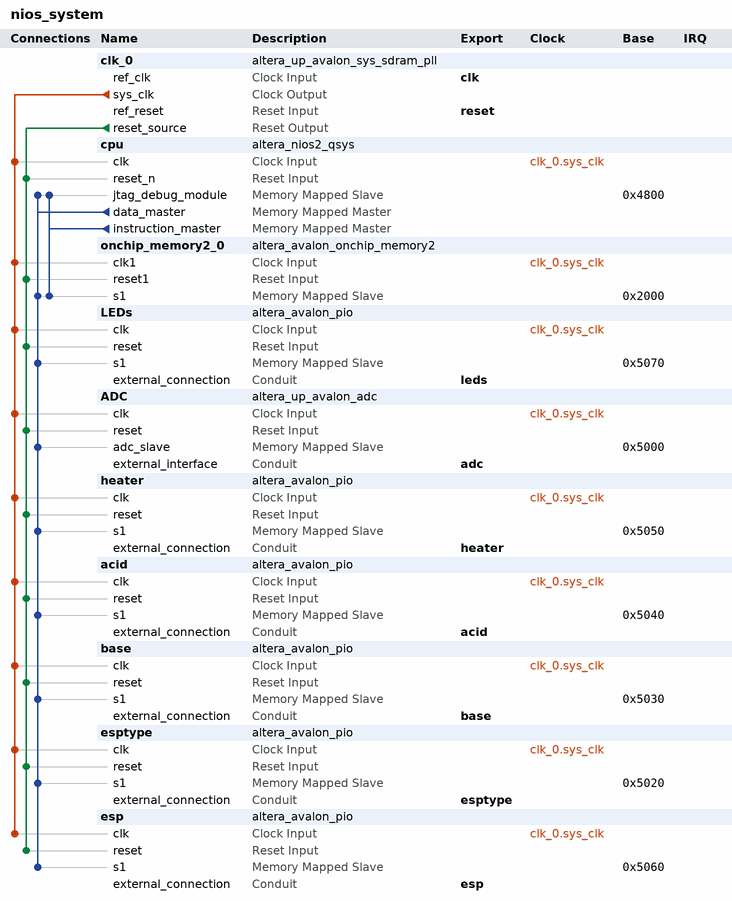
[diagram p0: system contents]
# Platform Designer (Qsys) system nios_system, Cyclone V 5CSEBA6U23I7
# Parameters at their usual value, and those the tool derives, are not listed.
package require -exact qsys 18.1
create_system nios_system
set_project_property DEVICE_FAMILY {Cyclone V}
set_project_property DEVICE 5CSEBA6U23I7

add_instance clk_0 altera_up_avalon_sys_sdram_pll 18.0
set_instance_parameter_value clk_0 CV_boards DE10-Nano
set_instance_parameter_value clk_0 gui_outclk 100.0
set_instance_parameter_value clk_0 gui_refclk 50.0

add_instance cpu altera_nios2_qsys 16.1
set_instance_parameter_value cpu breakSlave cpu.jtag_debug_module
set_instance_parameter_value cpu exceptionSlave onchip_memory2_0.s1
set_instance_parameter_value cpu icache_size 4096
set_instance_parameter_value cpu impl Tiny
set_instance_parameter_value cpu mmu_TLBMissExcSlave None
set_instance_parameter_value cpu resetSlave onchip_memory2_0.s1
set_instance_parameter_value cpu resetrequest_enabled true

add_instance onchip_memory2_0 altera_avalon_onchip_memory2 18.1
set_instance_parameter_value onchip_memory2_0 dataWidth 32
set_instance_parameter_value onchip_memory2_0 dualPort false
set_instance_parameter_value onchip_memory2_0 initMemContent true
set_instance_parameter_value onchip_memory2_0 initializationFileName C:/Users/Admin/OneDrive/Desktop/USM/InnovateFPGA/Coding/adc_final_restored/software/Biogas/mem_init/nios_system_onchip_memory2_0.hex
set_instance_parameter_value onchip_memory2_0 memorySize 8192
set_instance_parameter_value onchip_memory2_0 useNonDefaultInitFile true

add_instance LEDs altera_avalon_pio 18.1
set_instance_parameter_value LEDs direction Output
set_instance_parameter_value LEDs width 8

add_instance ADC altera_up_avalon_adc 18.0
set_instance_parameter_value ADC board DE10-Nano
set_instance_parameter_value ADC numch_ 3

add_instance heater altera_avalon_pio 18.1
set_instance_parameter_value heater direction Output
set_instance_parameter_value heater width 1

add_instance acid altera_avalon_pio 18.1
set_instance_parameter_value acid direction Output
set_instance_parameter_value acid width 1

add_instance base altera_avalon_pio 18.1
set_instance_parameter_value base direction Output
set_instance_parameter_value base width 1

add_instance esptype altera_avalon_pio 18.1
set_instance_parameter_value esptype direction Output
set_instance_parameter_value esptype width 2

add_instance esp altera_avalon_pio 18.1
set_instance_parameter_value esp direction Output
set_instance_parameter_value esp width 8

# connections
add_connection clk_0.sys_clk acid.clk clock
add_connection clk_0.sys_clk ADC.clk clock
add_connection clk_0.sys_clk base.clk clock
add_connection clk_0.sys_clk cpu.clk clock
add_connection clk_0.sys_clk esp.clk clock
add_connection clk_0.sys_clk esptype.clk clock
add_connection clk_0.sys_clk heater.clk clock
add_connection clk_0.sys_clk LEDs.clk clock
add_connection clk_0.sys_clk onchip_memory2_0.clk1 clock
add_connection clk_0.reset_source acid.reset reset
add_connection clk_0.reset_source ADC.reset reset
add_connection clk_0.reset_source base.reset reset
add_connection clk_0.reset_source cpu.reset_n reset
add_connection clk_0.reset_source esp.reset reset
add_connection clk_0.reset_source esptype.reset reset
add_connection clk_0.reset_source heater.reset reset
add_connection clk_0.reset_source LEDs.reset reset
add_connection clk_0.reset_source onchip_memory2_0.reset1 reset
add_connection cpu.data_master acid.s1 avalon
set_connection_parameter_value cpu.data_master/acid.s1 baseAddress 0x5040
add_connection cpu.data_master ADC.adc_slave avalon
set_connection_parameter_value cpu.data_master/ADC.adc_slave baseAddress 0x5000
add_connection cpu.data_master base.s1 avalon
set_connection_parameter_value cpu.data_master/base.s1 baseAddress 0x5030
add_connection cpu.data_master cpu.jtag_debug_module avalon
set_connection_parameter_value cpu.data_master/cpu.jtag_debug_module baseAddress 0x4800
add_connection cpu.data_master esp.s1 avalon
set_connection_parameter_value cpu.data_master/esp.s1 baseAddress 0x5060
add_connection cpu.data_master esptype.s1 avalon
set_connection_parameter_value cpu.data_master/esptype.s1 baseAddress 0x5020
add_connection cpu.data_master heater.s1 avalon
set_connection_parameter_value cpu.data_master/heater.s1 baseAddress 0x5050
add_connection cpu.data_master LEDs.s1 avalon
set_connection_parameter_value cpu.data_master/LEDs.s1 baseAddress 0x5070
add_connection cpu.data_master onchip_memory2_0.s1 avalon
set_connection_parameter_value cpu.data_master/onchip_memory2_0.s1 baseAddress 0x2000
add_connection cpu.instruction_master cpu.jtag_debug_module avalon
set_connection_parameter_value cpu.instruction_master/cpu.jtag_debug_module baseAddress 0x4800
add_connection cpu.instruction_master onchip_memory2_0.s1 avalon
set_connection_parameter_value cpu.instruction_master/onchip_memory2_0.s1 baseAddress 0x2000

# exported interfaces
add_interface acid conduit end
set_interface_property acid EXPORT_OF acid.external_connection
add_interface adc conduit end
set_interface_property adc EXPORT_OF ADC.external_interface
add_interface base conduit end
set_interface_property base EXPORT_OF base.external_connection
add_interface clk clock sink
set_interface_property clk EXPORT_OF clk_0.ref_clk
add_interface esp conduit end
set_interface_property esp EXPORT_OF esp.external_connection
add_interface esptype conduit end
set_interface_property esptype EXPORT_OF esptype.external_connection
add_interface heater conduit end
set_interface_property heater EXPORT_OF heater.external_connection
add_interface leds conduit end
set_interface_property leds EXPORT_OF LEDs.external_connection
add_interface reset reset sink
set_interface_property reset EXPORT_OF clk_0.ref_reset

set_interconnect_requirement {$system} qsys_mm.clockCrossingAdapter HANDSHAKE
set_interconnect_requirement {$system} qsys_mm.enableEccProtection FALSE
set_interconnect_requirement {$system} qsys_mm.insertDefaultSlave FALSE
set_interconnect_requirement {$system} qsys_mm.maxAdditionalLatency 1

save_system nios_system.qsys
